# Altium schematic sheet euu.SchDoc
size A4
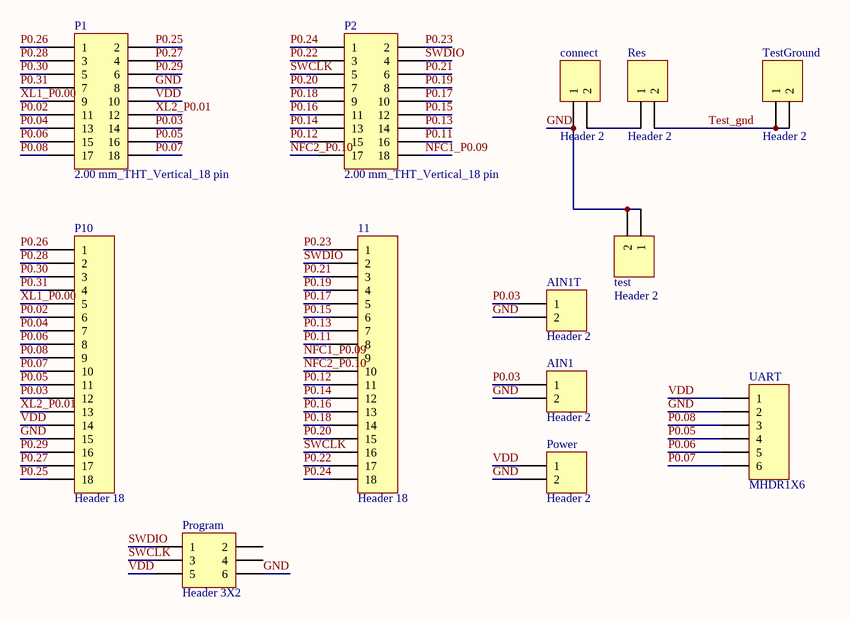
[diagram p0: euu.SchDoc]

## Parts
11  Header 18  [HDR1X18]
AIN1  Header 2  [HDR1X2]
AIN1T  Header 2  [HDR1X2]
connect  Header 2  [HDR1X2]
P1  2.00 mm_THT_Vertical_18 pin  [Header9x2]
P2  2.00 mm_THT_Vertical_18 pin  [Header9x2]
P10  Header 18  [HDR1X18]
Power  Header 2  [HDR1X2]
Program  Header 3X2  [HDR2X3]
Res  Header 2  [HDR1X2]
test  Header 2  [HDR1X2]
TestGround  Header 2  [HDR1X2]
UART  MHDR1X6  [HEADER6]

## Nets
GND: AIN1.2 AIN1T.2 connect.1 P1.8 P10.15 Power.2 Program.6 test.1 test.2 UART.2
NFC1_P0.09: 11.9 P2.18
NFC2_P0.10: 11.10 P2.17
P0.02: P1.11 P10.6
P0.03: AIN1.1 AIN1T.1 P1.14 P10.12
P0.04: P1.13 P10.7
P0.05: P1.16 P10.11 UART.4
P0.06: P1.15 P10.8 UART.5
P0.07: P1.18 P10.10 UART.6
P0.08: P1.17 P10.9 UART.3
P0.11: 11.8 P2.16
P0.12: 11.11 P2.15
P0.13: 11.7 P2.14
P0.14: 11.12 P2.13
P0.15: 11.6 P2.12
P0.16: 11.13 P2.11
P0.17: 11.5 P2.10
P0.18: 11.14 P2.9
P0.19: 11.4 P2.8
P0.20: 11.15 P2.7
P0.21: 11.3 P2.6
P0.22: 11.17 P2.3
P0.23: 11.1 P2.2
P0.24: 11.18 P2.1
P0.25: P1.2 P10.18
P0.26: P1.1 P10.1
P0.27: P1.4 P10.17
P0.28: P1.3 P10.2
P0.29: P1.6 P10.16
P0.30: P1.5 P10.3
P0.31: P1.7 P10.4
SWCLK: 11.16 P2.5 Program.3
SWDIO: 11.2 P2.4 Program.1
Test_gnd: Res.2 TestGround.1 TestGround.2
VDD: P1.10 P10.14 Power.1 Program.5 UART.1
XL1_P0.00: P1.9 P10.5
XL2_P0.01: P1.12 P10.13
Netconnect_2: connect.2 Res.1

Not connected (* = marked no-connect by the designer): Program 2 4

## Library data of the parts
11 P10 = Header 18: Header, 18-Pin; LatestRevisionDate: 17-Jul-2002; LatestRevisionNote: Re-released for DXP Platform.; Publisher: Altium Limited
AIN1 AIN1T connect Power Res test TestGround = Header 2: Header, 2-Pin; LatestRevisionDate: 17-Jul-2002; LatestRevisionNote: Re-released for DXP Platform.; Publisher: Altium Limited
P1 P2 = Header 9X2: Header, 9-Pin, Dual row; LatestRevisionDate: 17-Jul-2002; LatestRevisionNote: Re-released for DXP Platform.; Publisher: Altium Limited
Program = Header 3X2: Header, 3-Pin, Dual row; LatestRevisionDate: 17-Jul-2002; LatestRevisionNote: Re-released for DXP Platform.; Publisher: Altium Limited
UART = MHDR1X6: Header, 6-Pin; LatestRevisionDate: 17-Jul-2002; LatestRevisionNote: Re-released for DXP Platform.; Publisher: Altium Limited